# EAGLE schematic Bean_revE (EAGLE 7.3.0)
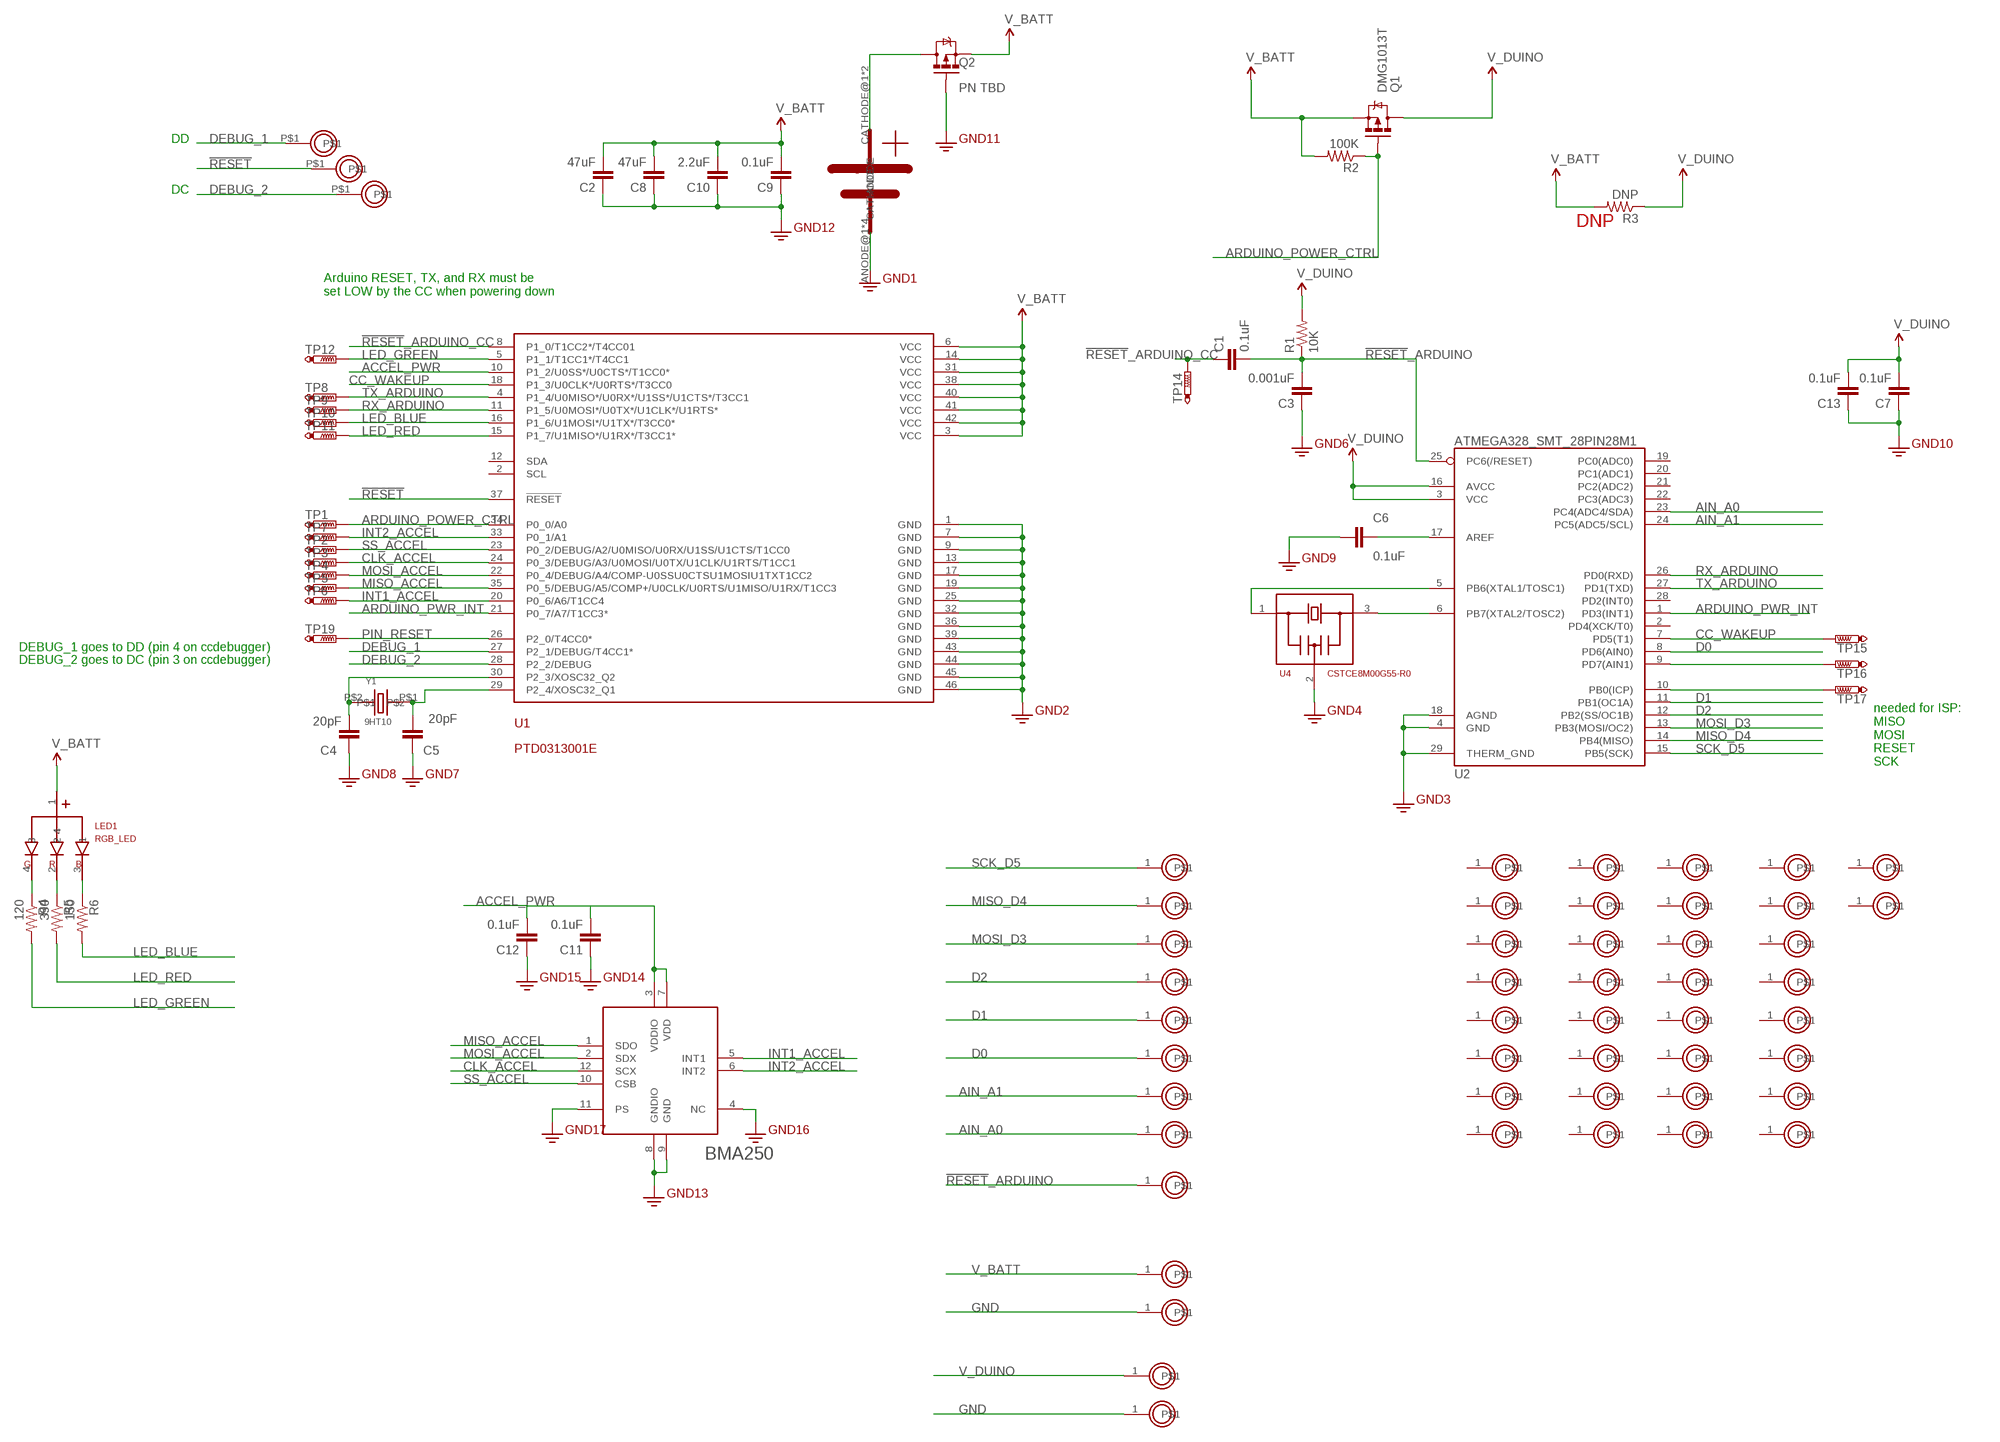
[diagram p0: schematic, sheet 1]

## Parts
C1  0.1uF  CAPACITOR_CERAMIC  [0402]
C2  47uF  CAP0805  [0805]
C3  0.001uF  CAPACITOR_CERAMIC  [0402]
C4  20pF  CAPACITOR_CERAMIC  [0402]
C5  20pF  CAPACITOR_CERAMIC  [0402]
C6  0.1uF  CAPACITOR_CERAMIC  [0402]
C7  0.1uF  CAPACITOR_CERAMIC  [0402]
C8  47uF  CAP0805  [0805]
C9  0.1uF  CAPACITOR_CERAMIC  [0402]
C10  2.2uF  CAP0603-CAP  [0603-CAP]
C11  0.1uF  CAPACITOR_CERAMIC  [0402]
C12  0.1uF  CAPACITOR_CERAMIC  [0402]
C13  0.1uF  CAPACITOR_CERAMIC  [0402]
CN_BATT  CR20324_ELEVATED_PADS  [BK-912-ALT]
LED1  RGB_LED  [SML-LX0404SIUPGUSB]
Q1  DMG1013T  MOSFET-PCHANNEL  [SOT523]
Q2  PN TBD  MOSFET-PCHANNEL  [SOT523]
R1  10K  RESISTOR  [0402]
R2  100K  RESISTOR  [0402]
R3  DNP  RESISTOR  [0402]
R4  120  RESISTOR  [0402]
R5  390  RESISTOR  [0402]
R6  150  RESISTOR  [0402]
TP1  PTR1TP06R  [TP06R]
TP2  PTR1TP06R  [TP06R]
TP3  PTR1TP06R  [TP06R]
TP4  PTR1TP06R  [TP06R]
TP5  PTR1TP06R  [TP06R]
TP6  PTR1TP06R  [TP06R]
TP7  PTR1TP06R  [TP06R]
TP8  PTR1TP06R  [TP06R]
TP9  PTR1TP06R  [TP06R]
TP10  PTR1TP06R  [TP06R]
TP11  PTR1TP06R  [TP06R]
TP12  PTR1TP06R  [TP06R]
TP14  PTR1TP06R  [TP06R]
TP15  PTR1TP06R  [TP06R]
TP16  PTR1TP06R  [TP06R]
TP17  PTR1TP06R  [TP06R]
TP19  PTR1TP14R  [TP14R]
U1  PTD0313001E  [PTD0313001E]
U2  ATMEGA328_SMT_28PIN28M1  [QFN-28-4X4]
U3  BMA250  [BMA250]
U4  CSTCE8M00G55-R0  RESONATOR_3PIN  [CSTCE_G_3PIN_XTAL]
U$1  PROTO_POINT  [1X01]
U$3  PROTO_POINT  [1X01]
U$4  PROTO_POINT  [1X01]
U$5  PROTO_POINT  [1X01]
U$6  PROTO_POINT  [1X01]
U$7  PROTO_POINT  [1X01]
U$8  PROTO_POINT  [1X01]
U$9  PROTO_POINT  [1X01]
U$10  PROTO_POINT  [1X01]
U$11  PROTO_POINT  [1X01]
U$12  PROTO_POINT  [1X01]
U$13  PROTO_POINT  [1X01]
U$14  PROTO_POINT  [1X01]
U$15  PROTO_POINT  [1X01]
U$16  PROTO_POINT  [1X01]
U$17  PROTO_POINT  [1X01]
U$18  PROTO_POINT  [1X01]
U$19  PROTO_POINT  [1X01]
U$20  PROTO_POINT  [1X01]
U$21  PROTO_POINT  [1X01]
U$22  PROTO_POINT  [1X01]
U$23  PROTO_POINT  [1X01]
U$24  PROTO_POINT  [1X01]
U$25  PROTO_POINT  [1X01]
U$26  PROTO_POINT  [1X01]
U$27  PROTO_POINT  [1X01]
U$28  PROTO_POINT  [1X01]
U$29  PROTO_POINT  [1X01]
U$30  PROTO_POINT  [1X01]
U$31  PROTO_POINT  [1X01]
U$32  PROTO_POINT  [1X01]
U$33  PROTO_POINT  [1X01]
U$34  PROTO_POINT  [1X01]
U$35  PROTO_POINT  [1X01]
U$36  PROTO_POINT  [1X01]
U$37  PROTO_POINT  [1X01]
U$38  PROTO_POINT  [1X01]
U$39  PROTO_POINT  [1X01]
U$40  PROTO_POINT  [1X01]
U$41  PROTO_POINT  [1X01]
U$42  PROTO_POINT  [1X01]
U$43  PROTO_POINT  [1X01]
U$44  PROTO_POINT  [1X01]
U$45  PROTO_POINT  [1X01]
U$46  PROTO_POINT  [1X01]
U$49  BEAN_PROGRAM_PIN  [BEAN_PROGAM_PIN]
U$50  BEAN_PROGRAM_PIN  [BEAN_PROGAM_PIN]
U$51  BEAN_PROGRAM_PIN  [BEAN_PROGAM_PIN]
U$52  PROTO_POINT  [1X01]
U$53  PROTO_POINT  [1X01]
Y1  9HT10  [9HT10]

## Nets
!RESET!: U1.37(!RESET!) U$50.P$1
!RESET!_ARDUINO: C1.P$2 C3.P$2 R1.P$1 U2.25(PC6(/RESET)) U$46.1
!RESET!_ARDUINO_CC: C1.P$1 TP14.TP U1.8(P1_0/T1CC2*/T4CC01)
ACCEL_PWR: C11.P$2 C12.P$2 U1.10(P1_2/U0SS*/U0CTS*/T1CC0*) U3.3(VDDIO) U3.7(VDD)
AIN_A0: U2.23(PC4(ADC4/SDA)) U$10.1
AIN_A1: U2.24(PC5(ADC5/SCL)) U$9.1
ARDUINO_POWER_CTRL: Q1.G R2.P$1 TP1.TP U1.34(P0_0/A0)
ARDUINO_PWR_INT: U1.21(P0_7/A7/T1CC3*) U2.1(PD3(INT1))
CC_WAKEUP: TP15.TP U1.18(P1_3/U0CLK*/U0RTS*/T3CC0) U2.7(PD5(T1))
CLK_ACCEL: TP3.TP U1.24(P0_3/DEBUG/A3/U0MOSI/U0TX/U1CLK/U1RTS/T1CC1) U3.12(SCX)
D0: U2.8(PD6(AIN0)) U$8.1
D1: U2.11(PB1(OC1A)) U$7.1
D2: U2.12(PB2(SS/OC1B)) U$6.1
DEBUG_1: U1.27(P2_1/DEBUG/T4CC1*) U$51.P$1
DEBUG_2: U1.28(P2_2/DEBUG) U$49.P$1
GND: C2.1 C3.P$1 C4.P$1 C5.P$1 C6.P$1 C7.P$1 C8.1 C9.P$1 C10.1 C11.P$1 C12.P$1 C13.P$1 CN_BATT.ANODE@1(ANODE) CN_BATT.ANODE@2(ANODE) CN_BATT.ANODE@3(ANODE) CN_BATT.ANODE@4(ANODE) Q2.G U1.1(GND) U1.7(GND) U1.9(GND) U1.13(GND) U1.17(GND) U1.19(GND) U1.25(GND) U1.32(GND) U1.36(GND) U1.39(GND) U1.43(GND) U1.44(GND) U1.45(GND) U1.46(GND) U2.4(GND) U2.18(AGND) U2.29(THERM_GND) U3.4(NC) U3.8(GNDIO) U3.9(GND) U3.11(PS) U4.2 U$45.1 U$53.1 ; supply symbol labelled GND2
INT1_ACCEL: TP6.TP U1.20(P0_6/A6/T1CC4) U3.5(INT1)
INT2_ACCEL: TP7.TP U1.33(P0_1/A1) U3.6(INT2)
LED_BLUE: R6.P$2 TP10.TP U1.16(P1_6/U1MOSI*/U1TX*/T3CC0*)
LED_GREEN: R4.P$2 TP12.TP U1.5(P1_1/T1CC1*/T4CC1)
LED_RED: R5.P$2 TP11.TP U1.15(P1_7/U1MISO*/U1RX*/T3CC1*)
MISO_ACCEL: TP5.TP U1.35(P0_5/DEBUG/A5/COMP+/U0CLK/U0RTS/U1MISO/U1RX/T1CC3) U3.1(SDO)
MISO_D4: U2.14(PB4(MISO)) U$4.1
MOSI_ACCEL: TP4.TP U1.22(P0_4/DEBUG/A4/COMP-U0SSU0CTSU1MOSIU1TXT1CC2) U3.2(SDX)
MOSI_D3: U2.13(PB3(MOSI/OC2)) U$5.1
N$1: U2.5(PB6(XTAL1/TOSC1)) U4.1
N$2: U2.6(PB7(XTAL2/TOSC2)) U4.3
N$3: C4.P$2 U1.30(P2_3/XOSC32_Q2) Y1.P$2
N$4: C5.P$2 U1.29(P2_4/XOSC32_Q1) Y1.P$1
N$6: C6.P$2 U2.17(AREF)
N$23: LED1.4 R4.P$1
N$24: LED1.2 R5.P$1
N$25: LED1.3 R6.P$1
PB0: TP17.TP U2.10(PB0(ICP))
PD7: TP16.TP U2.9(PD7(AIN1))
PIN_RESET: TP19.TP U1.26(P2_0/T4CC0*)
PRE_V_BATT: CN_BATT.CATHODE@1(CATHODE) CN_BATT.CATHODE@2(CATHODE) Q2.D
RX_ARDUINO: TP9.TP U1.11(P1_5/U0MOSI*/U0TX*/U1CLK*/U1RTS*) U2.26(PD0(RXD))
SCK_D5: U2.15(PB5(SCK)) U$3.1
SS_ACCEL: TP2.TP U1.23(P0_2/DEBUG/A2/U0MISO/U0RX/U1SS/U1CTS/T1CC0) U3.10(CSB)
TX_ARDUINO: TP8.TP U1.4(P1_4/U0MISO*/U0RX*/U1SS*/U1CTS*/T3CC1) U2.27(PD1(TXD))
V_BATT: C2.2 C8.2 C9.P$2 C10.2 LED1.1 Q1.S Q2.S R2.P$2 R3.P$2 U1.3(VCC) U1.6(VCC) U1.14(VCC) U1.31(VCC) U1.38(VCC) U1.40(VCC) U1.41(VCC) U1.42(VCC) U$52.1
V_DUINO: C7.P$2 C13.P$2 Q1.D R1.P$2 R3.P$1 U2.3(VCC) U2.16(AVCC) U$1.1
Unconnected: U1.2(SCL) U1.12(SDA) U2.2(PD4(XCK/T0)) U2.19(PC0(ADC0)) U2.20(PC1(ADC1)) U2.21(PC2(ADC2)) U2.22(PC3(ADC3)) U2.28(PD2(INT0)) U$11.1 U$12.1 U$13.1 U$14.1 U$15.1 U$16.1 U$17.1 U$18.1 U$19.1 U$20.1 U$21.1 U$22.1 U$23.1 U$24.1 U$25.1 U$26.1 U$27.1 U$28.1 U$29.1 U$30.1 U$31.1 U$32.1 U$33.1 U$34.1 U$35.1 U$36.1 U$37.1 U$38.1 U$39.1 U$40.1 U$41.1 U$42.1 U$43.1 U$44.1

## Notes on the sheet
- DD
- DC
- DNP
- Arduino RESET, TX, and RX must be
  set LOW by the CC when powering down
- DEBUG_1 goes to DD (pin 4 on ccdebugger)
- DEBUG_2 goes to DC (pin 3 on ccdebugger)
- needed for ISP: 
  MISO
  MOSI
  RESET
  SCK

## Library data of the parts
C1 C3-C7 C9 C11-C13 = BLEduino Bean:CAPACITOR_CERAMIC
C2 C8 = BLEduino Bean:CAP: Capacitor Standard 0603 ceramic capacitor, and 0.1" leaded capacitor.
C10 = SparkFun-Capacitors:CAP: Capacitor Standard 0603 ceramic capacitor, and 0.1" leaded capacitor.
CN_BATT = BLEduino Bean:CR2032
LED1 = BLEduino Bean:RGB_LED
Q1 Q2 = BLEduino Bean:MOSFET-PCHANNEL: Generic PMOSFET
R1-R6 = BLEduino Bean:RESISTOR
TP1-TP12 TP14-TP17 TP19 = testpad:PTR1: TEST PIN
U1 = BLEduino Bean:PTD0313001E
U2 = BLEduino Bean:ATMEGA328_SMT_28PIN
U3 = BLEduino Bean:BMA250: Digital Accelerometer
U4 = BLEduino Bean:RESONATOR_3PIN
U$1 U$3-U$46 U$52 U$53 = BLEduino Bean:PROTO_POINT
U$49-U$51 = BeanLibrary:BEAN_PROGRAM_PIN
Y1 = BLEduino Bean:9HT10